# EAGLE design Led_Board (EAGLE 7.4.0)
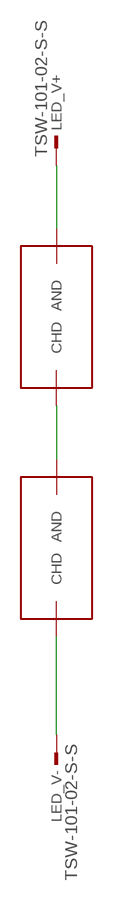
[diagram p0: schematic, sheet 1]

## Parts
LED_V+  TSW-101-02-S-S  [TSW-101-02-S-S]
LED_V-  TSW-101-02-S-S  [TSW-101-02-S-S]
U$1  TL1F2-NW1  [TL1F2-NW1]
U$2  TL1F2-NW1  [TL1F2-NW1]

## Nets
N$1: LED_V-.1 U$2.CATHODE(CHD)
N$2: U$1.CATHODE(CHD) U$2.ANODE(AND)
N$3: LED_V+.1 U$1.ANODE(AND)

## Library data of the parts
LED_V+ LED_V- = con-samtec:TSW-101-02-S-S: THROUGH-HOLE .025" SQ POST HEADER Source: Samtec TSW.pdf; OC_FARNELL: unknown; OC_NEWARK: unknown
U$1 U$2 = T03_CustomLib:TL1F2-NW1

## Board
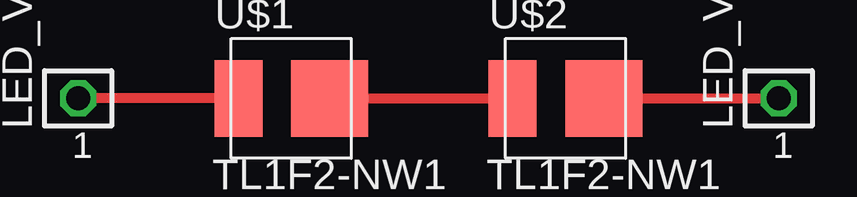
[diagram p1: board, top side]
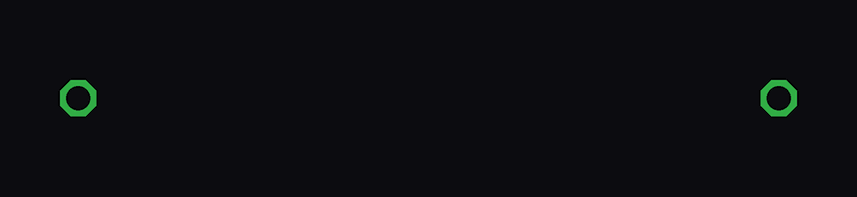
[diagram p2: board, bottom side, seen from below]

No outline drawn. Coordinates in mm, seen from the top.
Copper layers (1*16): Top 0.035mm / dielectric 1.5mm / Bottom 0.035mm
Design rules "default": minimum track width 10mil, minimum drill 24mil, track to track 8mil, track to pad 8mil, pad to pad 8mil, via to via 8mil, smd to smd 8mil, copper to edge 40mil, drill to drill 8mil, minimum pad ring 10mil, minimum via ring 8mil, stop-mask expansion 4mil, vias tented up to drill 0mil, thermal gap 10mil

### Footprints (pad centres in the part's own frame; a part is rotated, then mirrored left to right if it is on the bottom)
TSW-101-02-S-S = drill 1 pad 1.5 octagon: 1 0,0
TL1F2-NW1 = smd 2 x 3.2: ANODE -2.2,0 | smd 3.2 x 3.2: CATHODE 1.6,0

### Placement (x,y rotation side)
LED_V+  3.81,19.05 0 top
LED_V-  33.02,19.05 0 top
U$1  12.7,19.05 0 top
U$2  24.13,19.05 0 top

### Tracks (layer width: path | path; a pad name or v marks a point on that pad's centre or on a via)
N$1
  Top 0.406: U$2.CATHODE LED_V-.1
N$2
  Top 0.406: U$1.CATHODE U$2.ANODE
N$3
  Top 0.406: U$1.ANODE LED_V+.1